# EAGLE design promini (EAGLE 7.6.0)
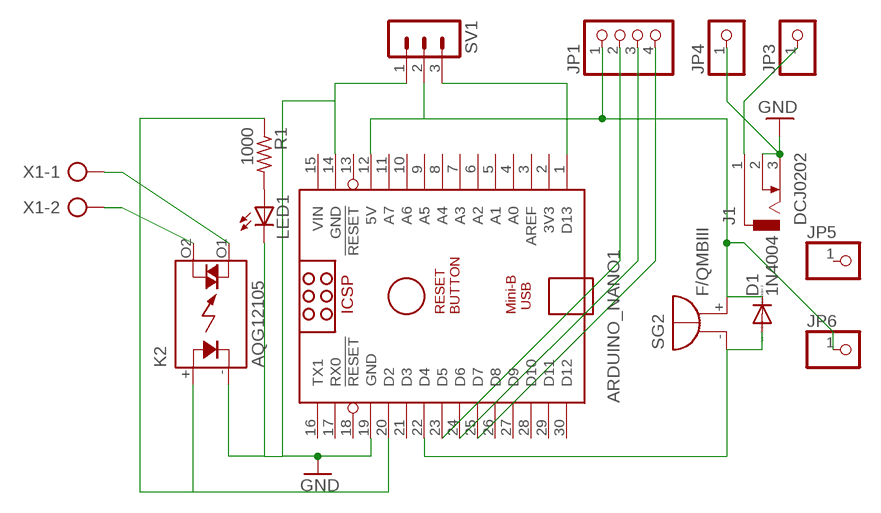
[diagram p0: schematic, sheet 1]

## Parts
ARDUINO_NANO1  ARDUINO_NANO  [ARDUINO_NANO]
D1  1N4004  [DO41-10]
J1  DCJ0202  [DCJ0202]
JP1  PINHD-1X4  [1X04]
JP3  PINHD-1X1  [1X01]
JP4  PINHD-1X1  [1X01]
JP5  PINHD-1X1  [1X01]
JP6  PINHD-1X1  [1X01]
K2  AQG12105  [AQG]
LED1  LED5MM  [LED5MM]
R1  1000  R-US_0204/7  [0204/7]
SG2  F/QMBIII  [F/QMBIII]
SV1  MA03-1  [MA03-1]
X1  AK300/2  [AK300/2]

## Nets
5V: ARDUINO_NANO1.12(5V) D1.C JP1.1 JP6.1 SG2.+(-) SV1.2
D2: ARDUINO_NANO1.20(D2) K2.+(A) R1.1
D4: ARDUINO_NANO1.22(D4) D1.A SG2.-(+)
D13: ARDUINO_NANO1.1(D13) SV1.3
GND: ARDUINO_NANO1.14(GND) ARDUINO_NANO1.19(GND) J1.2 J1.3 JP4.1 K2.-(K) LED1.K(C) SV1.1
N$1: K2.O2(DS1) X1.2
N$2: K2.O1(DS2) X1.1
N$3: ARDUINO_NANO1.23(D5) JP1.2
N$4: LED1.A R1.2
N$5: J1.1 JP3.1
N$6: ARDUINO_NANO1.24(D6) JP1.3
N$7: ARDUINO_NANO1.25(D7) JP1.4
Unconnected: ARDUINO_NANO1.2(3V3) ARDUINO_NANO1.3(AREF) ARDUINO_NANO1.4(A0) ARDUINO_NANO1.5(A1) ARDUINO_NANO1.6(A2) ARDUINO_NANO1.7(A3) ARDUINO_NANO1.8(A4) ARDUINO_NANO1.9(A5) ARDUINO_NANO1.10(A6) ARDUINO_NANO1.11(A7) ARDUINO_NANO1.13(!RESET) ARDUINO_NANO1.16(TX1) ARDUINO_NANO1.17(RX0) ARDUINO_NANO1.18(!RESET) ARDUINO_NANO1.21(D3) ARDUINO_NANO1.26(D8) ARDUINO_NANO1.27(D9) ARDUINO_NANO1.28(D10) ARDUINO_NANO1.29(D11) ARDUINO_NANO1.30(D12) JP5.1

## Power pins joined to a net without a drawn wire
VIN: ARDUINO_NANO1.15(VIN)

## Library data of the parts
ARDUINO_NANO1 = ArduinoNanoV30:ARDUINO_NANO: Arduino Nano V3.0 Overview: The Arduino Nano is a small, complete, and breadboard-friendly board based on the ATmega328 (Arduino Nano 3.x) or ATmega168 (Arduino Nano 2.x). It has more or less the same functionality of the Arduino Duemilanove, but in a different package. It lacks only a DC power jack, and works with a Mini-B USB cable instead of a standard one. The Nano was designed and is being produced by Gravitech. Specifications: Microcontroller Atmel ATmega168 or ATmega328 Operating Voltage (logic level) 5 V Input Voltage (recommended) 7-12 V Input Voltage (limits) 6-20 V Digital I/O Pins 14 (of which 6 provide PWM output) Analog Input Pins 8 DC Current per I/O Pin 40 mA Flash Memory 16 KB (ATmega168) or 32 KB (ATmega328) of which 2 KB used by bootloader SRAM 1 KB (ATmega168) or 2 KB (ATmega328) EEPROM 512 bytes (ATmega168) or 1 KB (ATmega328) Clock Speed 16 MHz Dimensions 0.73" x 1.70" Length 45 mm Width 18 mm Weigth 5 g Power: The Arduino Nano can be powered via the Mini-B USB connection, 6-20V unregulated external power supply (pin 30), or 5V regulated external power supply (pin 27). The power source is automatically selected to the highest voltage source. Memory: The ATmega168 has 16 KB of flash memory for storing code (of which 2 KB is used for the bootloader); the ATmega328 has 32 KB, (also with 2 KB used for the bootloader). The ATmega168 has 1 KB of SRAM and 512 bytes of EEPROM (which can be read and written with the EEPROM library); the ATmega328 has 2 KB of SRAM and 1 KB of EEPROM. Input and Output: Each of the 14 digital pins on the Nano can be used as an input or output, using pinMode(), digitalWrite(), and digitalRead() functions. They operate at 5 volts. Each pin can provide or receive a maximum of 40 mA and has an internal pull-up resistor (disconnected by default) of 20-50 kOhms. In addition, some pins have specialized functions. Visit Arduino - ArduinoBoardNano <https://www.arduino.cc/en/Main/ArduinoBoardNano>
D1 = diode:1N4004: DIODE general purpose rectifier, 1 A
J1 = con-jack:DCJ0202: DC POWER JACK Source: DCJ0202.pdf; OC_FARNELL: unknown; OC_NEWARK: unknown
JP1 = pinhead:PINHD-1X4: PIN HEADER
JP3-JP6 = pinhead:PINHD-1X1: PIN HEADER
K2 = relay:AQG*: SOLID STATE RELAY NAiS Zero-cross, Non zero-cross Source: http://www.mew-europe.com/.. en_ds_61611_0000.pdf; MF: AROMAT/ MATSUSHITA; MPN: AQG12105; OC_FARNELL: unknown; OC_NEWARK: 20J4759
LED1 = led:LED: LED OSRAM: - CHIPLED LG R971, LG N971, LY N971, LG Q971, LY Q971, LO R971, LY R971 LH N974, LH R974 LS Q976, LO Q976, LY Q976 LO Q996 - Hyper CHIPLED LW Q18S LB Q993, LB Q99A, LB R99A - SideLED LS A670, LO A670, LY A670, LG A670, LP A670 LB A673, LV A673, LT A673, LW A673 LH A674 LY A675 LS A676, LA A676, LO A676, LY A676, LW A676 LS A679, LY A679, LG A679 - Hyper Micro SIDELED® LS Y876, LA Y876, LO Y876, LY Y876 LT Y87S - SmartLED LW L88C, LW L88S LB L89C, LB L89S, LG L890 LS L89K, LO L89K, LY L89K LS L896, LA L896, LO L896, LY L896 - TOPLED LS T670, LO T670, LY T670, LG T670, LP T670 LSG T670, LSP T670, LSY T670, LOP T670, LYG T670 LG T671, LOG T671, LSG T671 LB T673, LV T673, LT T673, LW T673 LH T674 LS T676, LA T676, LO T676, LY T676, LB T676, LH T676, LSB T676, LW T676 LB T67C, LV T67C, LT T67C, LS T67K, LO T67K, LY T67K, LW E67C LS E67B, LA E67B, LO E67B, LY E67B, LB E67C, LV E67C, LT E67C LW T67C LS T679, LY T679, LG T679 LS T770, LO T770, LY T770, LG T770, LP T770 LB T773, LV T773, LT T773, LW T773 LH T774 LS E675, LA E675, LY E675, LS T675 LS T776, LA T776, LO T776, LY T776, LB T776 LHGB T686 LT T68C, LB T68C - Hyper Mini TOPLED® LB M676 - Mini TOPLED Santana® LG M470 LS M47K, LO M47K, LY M47K Source: http://www.osram.convergy.de LUXEON: - LUMILED® LXK2-PW12-R00, LXK2-PW12-S00, LXK2-PW14-U00, LXK2-PW14-V00 LXK2-PM12-R00, LXK2-PM12-S00, LXK2-PM14-U00 LXK2-PE12-Q00, LXK2-PE12-R00, LXK2-PE12-S00, LXK2-PE14-T00, LXK2-PE14-U00 LXK2-PB12-K00, LXK2-PB12-L00, LXK2-PB12-M00, LXK2-PB14-N00, LXK2-PB14-P00, LXK2-PB14-Q00 LXK2-PR12-L00, LXK2-PR12-M00, LXK2-PR14-Q00, LXK2-PR14-R00 LXK2-PD12-Q00, LXK2-PD12-R00, LXK2-PD12-S00 LXK2-PH12-R00, LXK2-PH12-S00 LXK2-PL12-P00, LXK2-PL12-Q00, LXK2-PL12-R00 Source: www.luxeon.com KINGBRIGHT: KA-3528ASYC Source: www.kingbright.com
R1 = rcl:R-US_: RESISTOR, American symbol
SG2 = buzzer:F/QMBIII: BUZZER Source: Buerklin; OC_FARNELL: unknown; OC_NEWARK: unknown
SV1 = con-lstb:MA03-1: PIN HEADER; OC_FARNELL: unknown; OC_NEWARK: unknown
X1 = con-ptr500:AK300/2: CONNECTOR; OC_FARNELL: unknown; OC_NEWARK: unknown

## Board
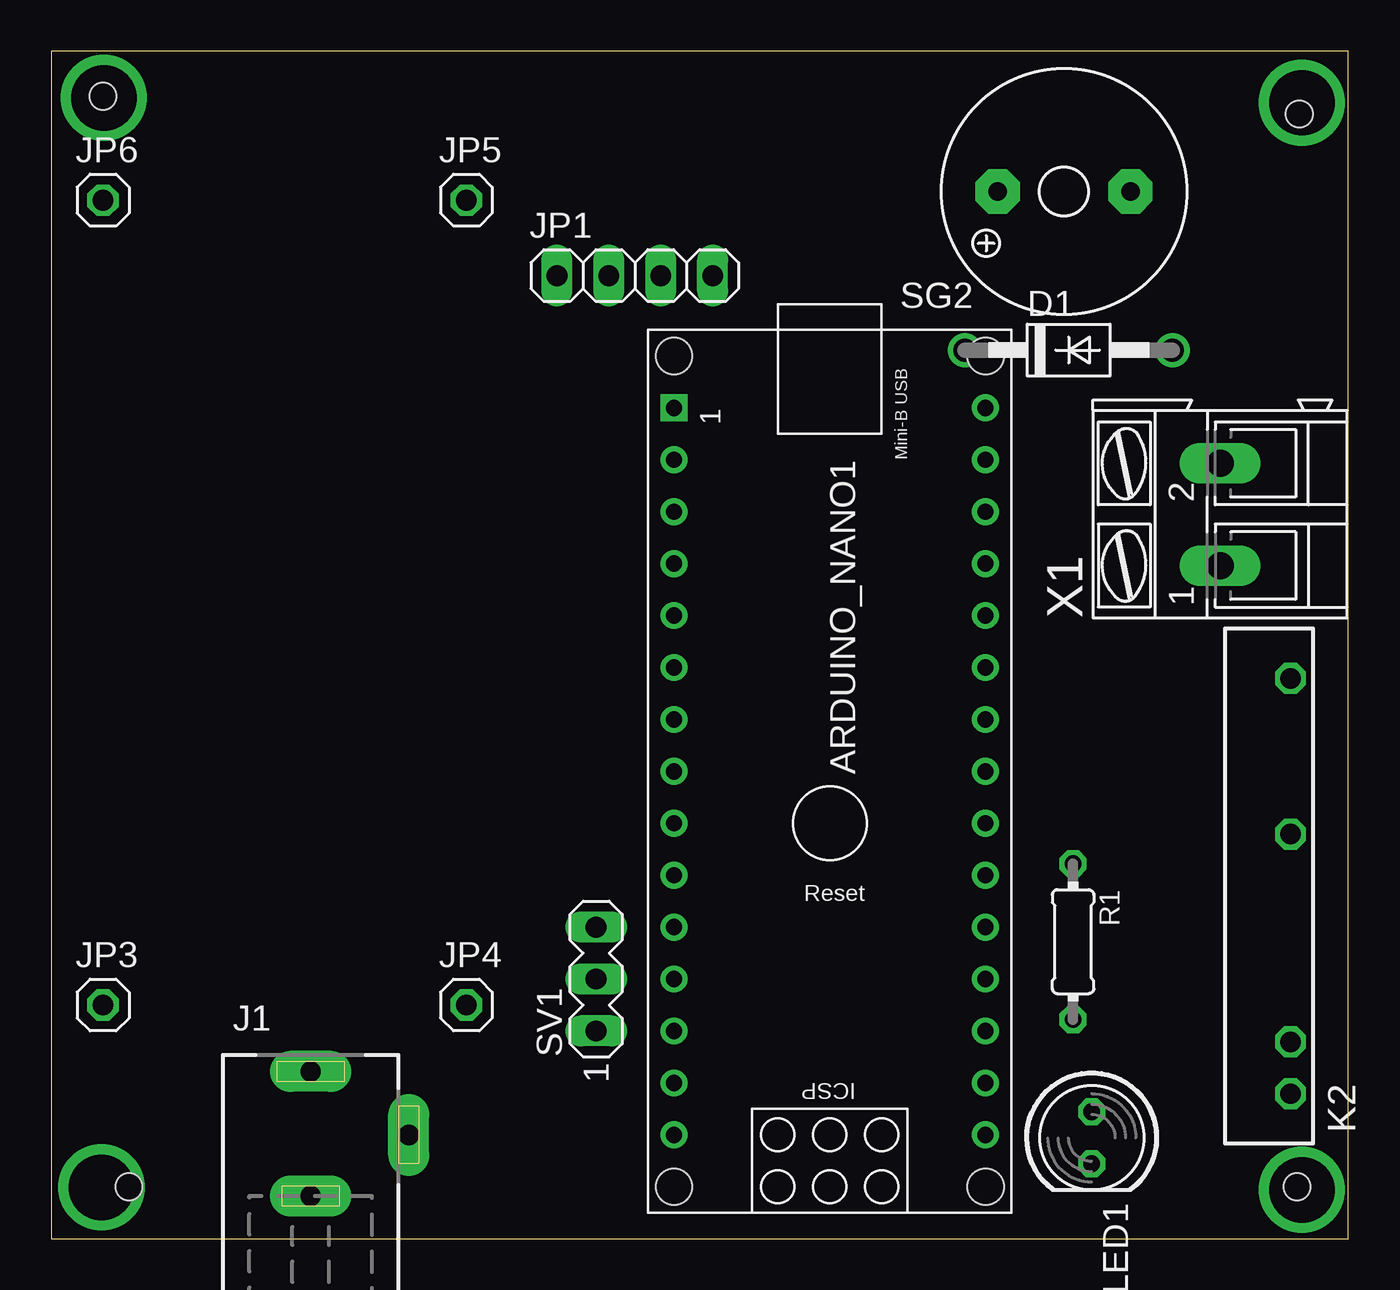
[diagram p1: board, top side]
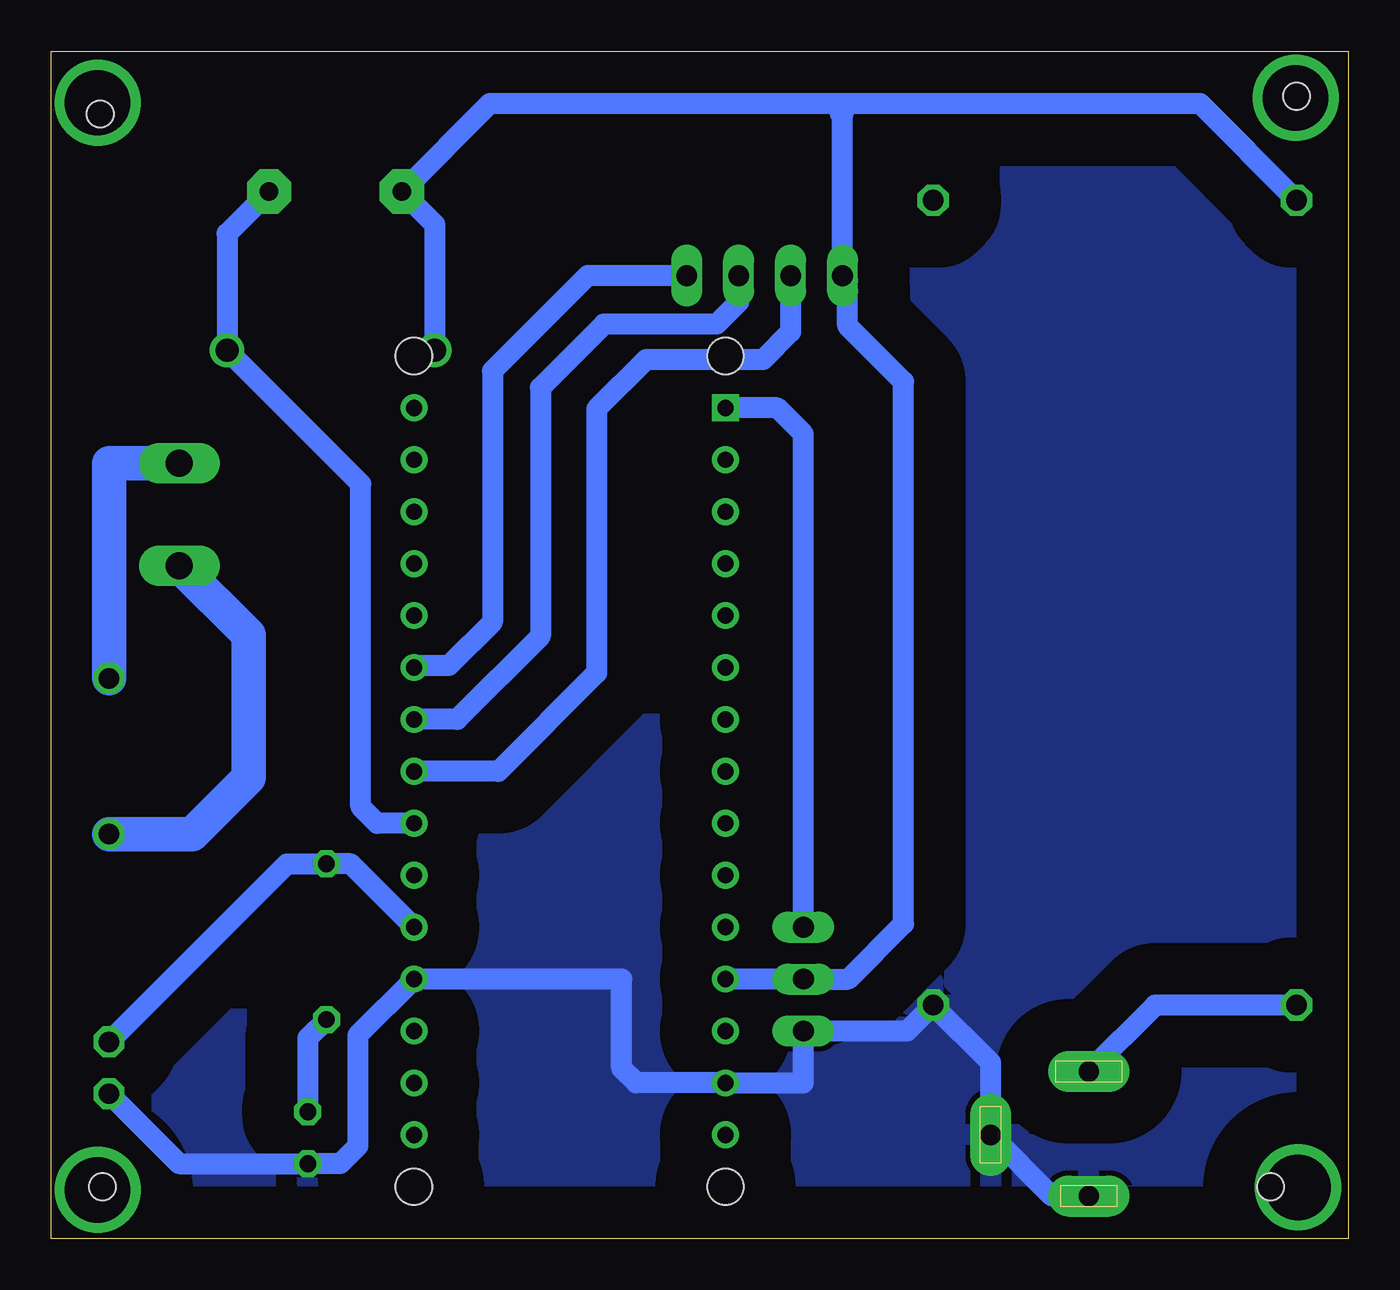
[diagram p2: board, bottom side, seen from below]

Size 63.48 x 58.09 mm. Coordinates in mm from the lower left corner, seen from the top.
Outline: 0,0 63.48,0 63.48,58.09 0,58.09 0,0
Copper layers (1*16): Top 0.035mm / dielectric 1.5mm / Bottom 0.035mm
Design rules "default": minimum track width 10mil, minimum drill 24mil, track to track 8mil, track to pad 8mil, pad to pad 8mil, via to via 8mil, smd to smd 8mil, copper to edge 40mil, drill to drill 8mil, minimum pad ring 10mil, minimum via ring 8mil, stop-mask expansion 4mil, vias tented up to drill 0mil, thermal gap 10mil
Holes 1.3 mm at 2.54,55.88 61.08,55.02 60.96,2.54 3.81,2.54

### Footprints (pad centres in the part's own frame; a part is rotated, then mirrored left to right if it is on the bottom)
ARDUINO_NANO = drill 0.8 square: 1 -20.32,-7.62 | drill 0.8: 2 -17.78,-7.62; 3 -15.24,-7.62; 4 -12.7,-7.62; 5 -10.16,-7.62; 6 -7.62,-7.62; 7 -5.08,-7.62; 8 -2.54,-7.62; 9 0,-7.62; 10 2.54,-7.62; 11 5.08,-7.62; 12 7.62,-7.62; 13 10.16,-7.62; 14 12.7,-7.62; 15 15.24,-7.62; 16 15.24,7.62; 17 12.7,7.62; 18 10.16,7.62; 19 7.62,7.62; 20 5.08,7.62; 21 2.54,7.62; 22 0,7.62; 23 -2.54,7.62; 24 -5.08,7.62; 25 -7.62,7.62; 26 -10.16,7.62; 27 -12.7,7.62; 28 -15.24,7.62; 29 -17.78,7.62; 30 -20.32,7.62 | hole 1.778: -22.86,-7.62; -22.86,7.62; 17.78,7.62; 17.78,-7.62
DO41-10 = drill 1.118: A 5.08,0; C -5.08,0
DCJ0202 = drill 1 pad 2 long: 1 0,3.1; 2 4.8,0; 3 0,-3
1X04 = drill 1.016 long: 1 -3.81,0; 2 -1.27,0; 3 1.27,0; 4 3.81,0
1X01 = drill 1.016 octagon: 1 0,0
AQG = drill 1 octagon: + -7.62,0; - -10.16,0; O1 2.54,0; O2 10.16,0
LED5MM = drill 0.813 octagon: A -1.27,0; K 1.27,0
0204/7 = drill 0.813 octagon: 1 -3.81,0; 2 3.81,0
F/QMBIII = drill 0.914 pad 2.159 octagon: + 3.251,0; - -3.251,0
MA03-1 = drill 1.016 long: 1 -2.54,0; 2 0,0; 3 2.54,0
AK300/2 = drill 1.321 long: 1 -2.515,0; 2 2.489,0

### Placement (x,y rotation side)
ARDUINO_NANO1  38.1,20.32 270 top
D1  49.79,43.46 0 top
J1  12.7,5.08 0 top
JP1  28.56,47.11 0 top
JP3  2.54,11.43 0 top
JP4  20.32,11.43 0 top
JP5  20.32,50.8 0 top
JP6  2.54,50.8 0 top
K2  60.65,17.25 90 top
LED1  50.92,4.94 270 top
R1  50.01,14.53 270 top
SG2  49.57,51.22 180 top
SV1  26.67,12.7 90 top
X1  57.21,35.44 90 top

### Tracks (layer width: path | path; a pad name or v marks a point on that pad's centre or on a via)
5V
  Bottom 1.016: D1.C 44.71,49.62 SG2.+ 42.02,55.52 24.38,55.52 | JP6.1 7.26,55.52 24.38,55.52 | 24.38,55.52 24.86,55.04 24.75,54.93 JP1.1 24.5,46.86 24.5,44.66 21.76,41.92 21.76,15.4 24.46,12.7 SV1.2 ARDUINO_NANO1.12
D2
  Bottom 1.016: K2.+ 51.93,18.34 R1.1 48.82,18.34 ARDUINO_NANO1.20
D4
  Bottom 1.016: ARDUINO_NANO1.22 47.52,20.32 48.33,21.13 48.33,36.92 D1.A 54.87,49.17 SG2.-
D13
  Bottom 1.016: SV1.3 26.67,39.37 27.94,40.64 ARDUINO_NANO1.1
GND
  Bottom 1.016: J1.3 14.5,2.08 J1.2 17.5,8.61 JP4.1 21.59,10.16 SV1.1 26.67,7.62 ARDUINO_NANO1.14 34.84,7.62 35.56,8.34 35.56,12.7 ARDUINO_NANO1.19 48.47,9.95 48.47,4.53 49.33,3.67 LED1.K 57.22,3.67 K2.-
  pour Bottom (isolate 2.54): 0.24,58.28 64.07,58.28 64.07,-0.17 -0.27,-0.17
N$1
  Bottom 1.676: X1.2 60.65,37.93 K2.O2
N$2
  Bottom 1.676: X1.1 53.82,29.53 53.82,22.54 56.57,19.79 K2.O1
N$3
  Bottom 1.016: JP1.2 27.29,44.36 28.64,43.01 34.36,43.01 36.78,40.59 36.78,27.68 41.6,22.86 ARDUINO_NANO1.23
N$4
  Bottom 1.016: R1.2 50.92,9.81 LED1.A
N$5
  Bottom 1.016: JP3.1 9.45,11.43 J1.1
N$6
  Bottom 1.016: JP1.3 29.83,45.82 30.92,44.73 36.43,44.73 39.54,41.62 39.54,29.47 43.61,25.4 ARDUINO_NANO1.24
N$7
  Bottom 1.016: JP1.4 37.23,47.11 41.88,42.45 41.88,30.16 44.02,28.03 45.63,28.03 ARDUINO_NANO1.25
N$8  (via drill 3.2)
  other vias: 2.58,55.8
N$9  (via drill 3.2)
  other vias: 61.2,55.57
N$10  (via drill 3.2)
  other vias: 61.2,2.39
N$11  (via drill 3.2)
  other vias: 2.46,2.51